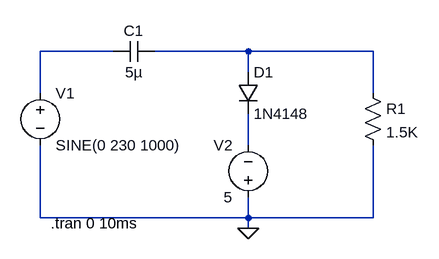
[diagram p0: schematic Negative and Positive Biased Clamper.asc]
Negative and Positive Biased Clamper.asc, the LTspice schematic file:
Version 4
SHEET 1 880 680
WIRE 272 224 160 224
WIRE 480 224 336 224
WIRE 672 224 480 224
WIRE 480 256 480 224
WIRE 160 288 160 224
WIRE 672 288 672 224
WIRE 480 368 480 320
WIRE 160 480 160 368
WIRE 480 480 480 448
WIRE 480 480 160 480
WIRE 672 480 672 368
WIRE 672 480 480 480
WIRE 480 496 480 480
FLAG 480 496 0
SYMBOL voltage 160 272 R0
SYMATTR InstName V1
SYMATTR Value SINE(0 230 1000)
SYMBOL voltage 480 464 R180
WINDOW 0 24 96 Left 2
WINDOW 3 24 16 Left 2
SYMATTR InstName V2
SYMATTR Value 5
SYMBOL cap 336 208 R90
WINDOW 0 0 32 VBottom 2
WINDOW 3 32 32 VTop 2
SYMATTR InstName C1
SYMATTR Value 5µ
SYMBOL res 656 272 R0
SYMATTR InstName R1
SYMATTR Value 1.5K
SYMBOL diode 464 256 R0
SYMATTR InstName D1
SYMATTR Value 1N4148
TEXT 176 488 Left 2 !.tran 0 10ms

The netlist it stands for:
* Negative and Positive Biased Clamper.asc
V1 N001 0 SINE(0 230 1000)
V2 0 N003 5
C1 N002 N001 5µ
R1 N002 0 1.5K
D1 N002 N003 1N4148
.model D D
.lib standard.dio
.tran 0 10ms
.backanno
.end